# EAGLE design AIRES_MEGA (EAGLE 9.5.2)
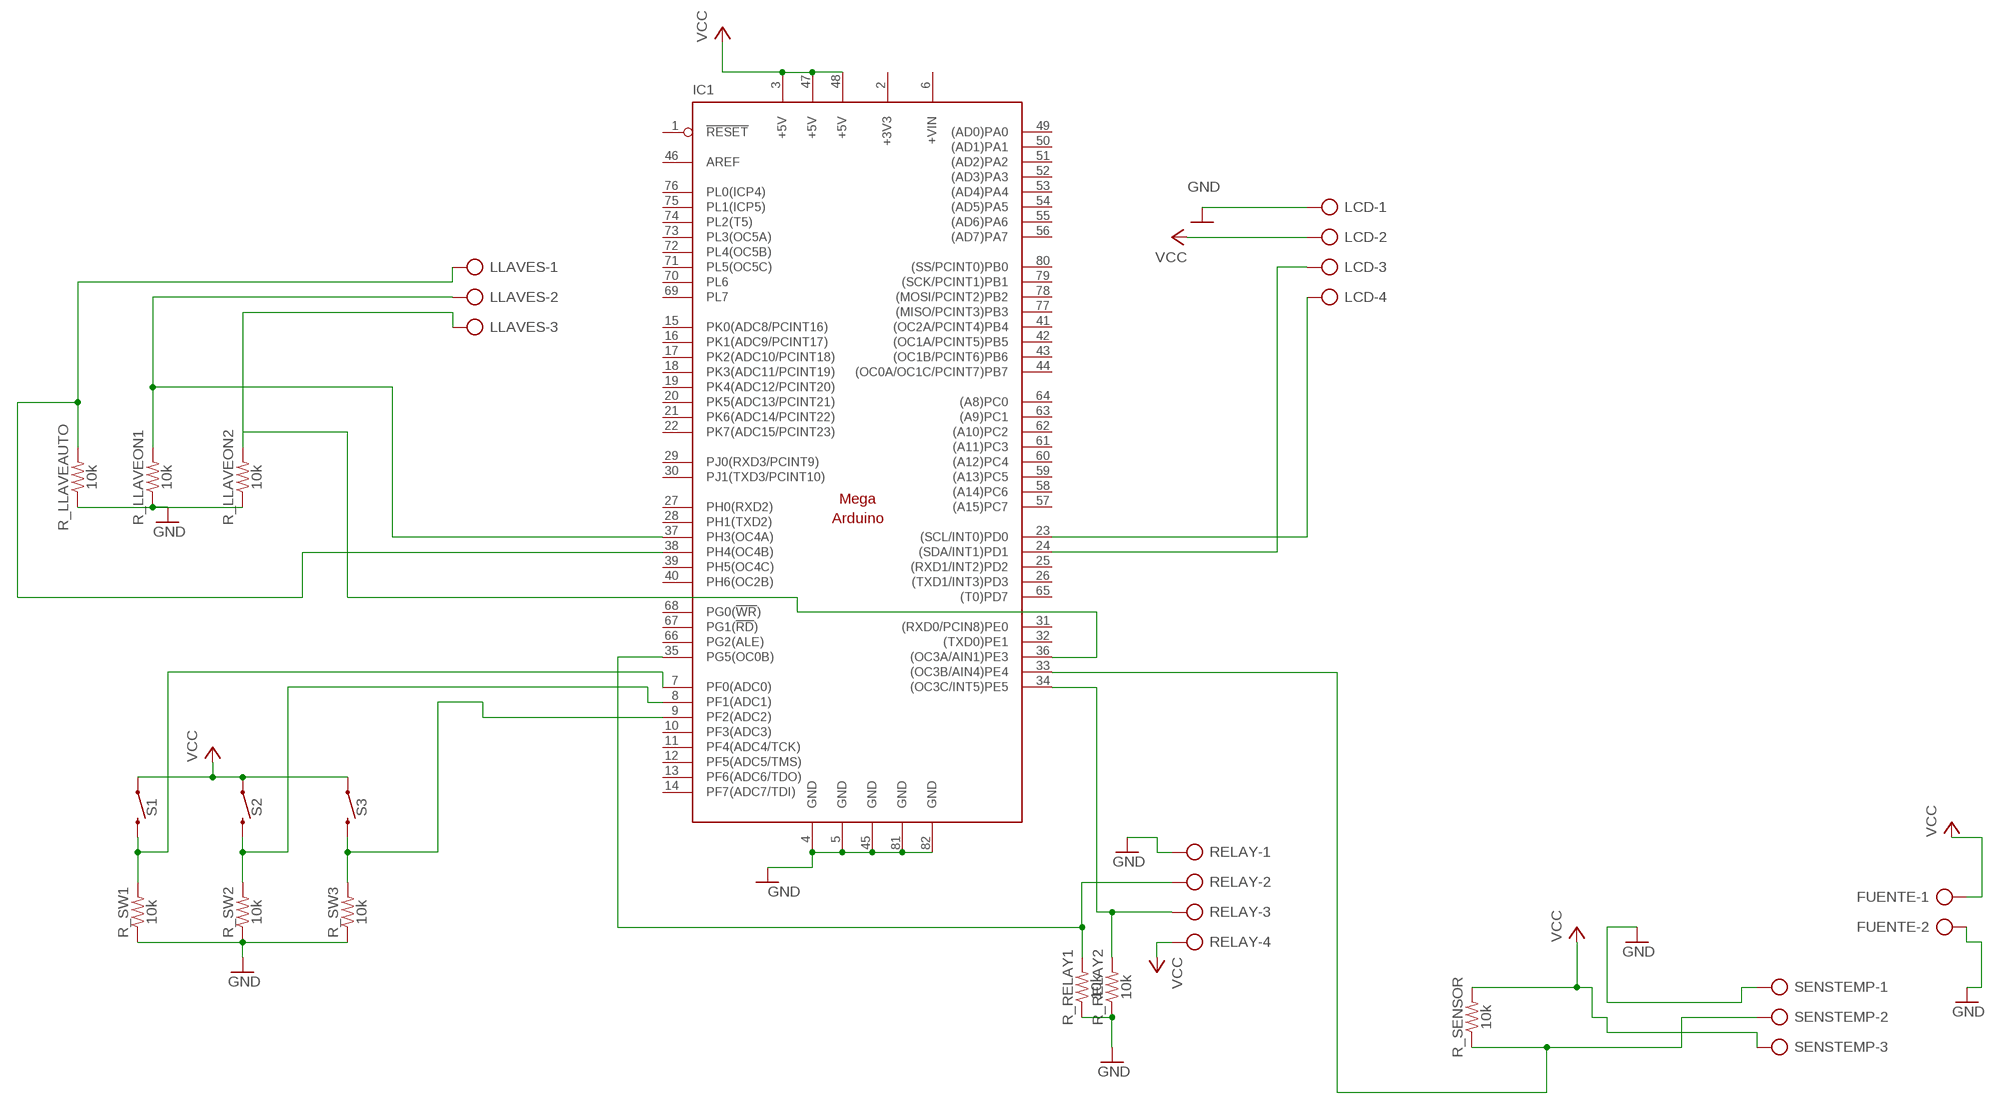
[diagram p0: schematic, sheet 1]

## Parts
FUENTE  AK500/2  [AK500/2]
IC1  MEGAARDUINO_1  [MEGA_ARDUINO]
LCD  AK500/4  [AK500/4]
LLAVES  AK500/3  [AK500/3]
R_LLAVEAUTO  10k  10KOHM-HORIZ-1/4W-1%  [AXIAL-0.3]
R_LLAVEON1  10k  10KOHM-HORIZ-1/4W-1%  [AXIAL-0.3]
R_LLAVEON2  10k  10KOHM-HORIZ-1/4W-1%  [AXIAL-0.3]
R_RELAY1  10k  10KOHM-HORIZ-1/4W-1%  [AXIAL-0.3]
R_RELAY2  10k  10KOHM-HORIZ-1/4W-1%  [AXIAL-0.3]
R_SENSOR  10k  10KOHM-HORIZ-1/4W-1%  [AXIAL-0.3]
R_SW1  10k  10KOHM-HORIZ-1/4W-1%  [AXIAL-0.3]
R_SW2  10k  10KOHM-HORIZ-1/4W-1%  [AXIAL-0.3]
R_SW3  10k  10KOHM-HORIZ-1/4W-1%  [AXIAL-0.3]
RELAY  AK500/4  [AK500/4]
S1  MOMENTARY-SWITCH-SPST-PTH-12MM  [TACTILE_SWITCH_PTH_12MM]
S2  MOMENTARY-SWITCH-SPST-PTH-12MM  [TACTILE_SWITCH_PTH_12MM]
S3  MOMENTARY-SWITCH-SPST-PTH-12MM  [TACTILE_SWITCH_PTH_12MM]
SENSTEMP  AK500/3  [AK500/3]

## Nets
GND: FUENTE.2 IC1.4(GND) IC1.5(GND) IC1.45(GND) IC1.81(GND) IC1.82(GND) LCD.1 R_LLAVEAUTO.P$1 R_LLAVEON1.P$1 R_LLAVEON2.P$1 R_RELAY1.P$1 R_RELAY2.P$1 R_SW1.P$1 R_SW2.P$1 R_SW3.P$1 RELAY.1 SENSTEMP.1
N$1: IC1.24((SDA/INT1)PD1) LCD.3
N$2: IC1.35(PG5(OC0B)) R_RELAY1.P$2 RELAY.2
N$4: IC1.38(PH4(OC4B)) LLAVES.1 R_LLAVEAUTO.P$2
N$5: IC1.7(PF0(ADC0)) R_SW1.P$2 S1.3
N$6: IC1.37(PH3(OC4A)) LLAVES.2 R_LLAVEON1.P$2
N$7: IC1.8(PF1(ADC1)) R_SW2.P$2 S2.3
N$8: IC1.23((SCL/INT0)PD0) LCD.4
N$9: IC1.34((OC3C/INT5)PE5) R_RELAY2.P$2 RELAY.3
N$11: IC1.9(PF2(ADC2)) R_SW3.P$2 S3.3
N$12: IC1.36((OC3A/AIN1)PE3) LLAVES.3 R_LLAVEON2.P$2
PIN_SENSOR: IC1.33((OC3B/AIN4)PE4) R_SENSOR.P$1 SENSTEMP.2
VCC: FUENTE.1 IC1.3(+5V) IC1.47(+5V) IC1.48(+5V) LCD.2 R_SENSOR.P$2 RELAY.4 S1.1 S2.1 S3.1 SENSTEMP.3
Unconnected: IC1.1(!RESET) IC1.10(PF3(ADC3)) IC1.11(PF4(ADC4/TCK)) IC1.12(PF5(ADC5/TMS)) IC1.13(PF6(ADC6/TDO)) IC1.14(PF7(ADC7/TDI)) IC1.15(PK0(ADC8/PCINT16)) IC1.16(PK1(ADC9/PCINT17)) IC1.17(PK2(ADC10/PCINT18)) IC1.18(PK3(ADC11/PCINT19)) IC1.19(PK4(ADC12/PCINT20)) IC1.20(PK5(ADC13/PCINT21)) IC1.21(PK6(ADC14/PCINT22)) IC1.22(PK7(ADC15/PCINT23)) IC1.25((RXD1/INT2)PD2) IC1.26((TXD1/INT3)PD3) IC1.27(PH0(RXD2)) IC1.28(PH1(TXD2)) IC1.29(PJ0(RXD3/PCINT9)) IC1.30(PJ1(TXD3/PCINT10)) IC1.31((RXD0/PCIN8)PE0) IC1.32((TXD0)PE1) IC1.39(PH5(OC4C)) IC1.40(PH6(OC2B)) IC1.41((OC2A/PCINT4)PB4) IC1.42((OC1A/PCINT5)PB5) IC1.43((OC1B/PCINT6)PB6) IC1.44((OC0A/OC1C/PCINT7)PB7) IC1.46(AREF) IC1.49((AD0)PA0) IC1.50((AD1)PA1) IC1.51((AD2)PA2) IC1.52((AD3)PA3) IC1.53((AD4)PA4) IC1.54((AD5)PA5) IC1.55((AD6)PA6) IC1.56((AD7)PA7) IC1.57((A15)PC7) IC1.58((A14)PC6) IC1.59((A13)PC5) IC1.60((A12)PC4) IC1.61((A11)PC3) IC1.62((A10)PC2) IC1.63((A9)PC1) IC1.64((A8)PC0) IC1.65((T0)PD7) IC1.66(PG2(ALE)) IC1.67(PG1(!RD!)) IC1.68(PG0(!WR!)) IC1.69(PL7) IC1.70(PL6) IC1.71(PL5(OC5C)) IC1.72(PL4(OC5B)) IC1.73(PL3(OC5A)) IC1.74(PL2(T5)) IC1.75(PL1(ICP5)) IC1.76(PL0(ICP4)) IC1.77((MISO/PCINT3)PB3) IC1.78((MOSI/PCINT2)PB2) IC1.79((SCK/PCINT1)PB1) IC1.80((SS/PCINT0)PB0)

## Power pins joined to a net without a drawn wire
+3V3: IC1.2(+3V3)
+VIN: IC1.6(+VIN)

## Library data of the parts
FUENTE = con-ptr500:AK500/2: CONNECTOR; OC_FARNELL: unknown; OC_NEWARK: unknown
IC1 = arduino:MEGAARDUINO_1: The Arduino Mega is a microcontroller board based on the ATmega1280. - 54 digital input/output pins (of which 14 can be used as PWM outputs) - 16 analog inputs - 4 UARTs (hardware serial ports) - 16 MHz crystal oscillator - USB connection - power jack - ICSP header - reset button It contains everything needed to support the microcontroller; simply connect it to a computer with a USB cable or power it with a AC-to-DC adapter or battery to get started. The Mega is compatible with most shields designed for the Arduino Duemilanove or Diecimila. http://arduino.cc/en/Main/ArduinoBoardMega
LCD RELAY = con-ptr500:AK500/4: CONNECTOR; OC_FARNELL: unknown; OC_NEWARK: unknown
LLAVES SENSTEMP = con-ptr500:AK500/3: CONNECTOR; OC_FARNELL: unknown; OC_NEWARK: unknown
R_LLAVEAUTO R_LLAVEON1 R_LLAVEON2 R_RELAY1 R_RELAY2 R_SENSOR R_SW1-R_SW3 = SparkFun-Resistors:10KOHM: 10kΩ resistor A resistor is a passive two-terminal electrical component that implements electrical resistance as a circuit element. Resistors act to reduce current flow, and, at the same time, act to lower voltage levels within circuits. - Wikipedia; PROD_ID: RES-12183
S1-S3 = SparkFun-Switches:MOMENTARY-SWITCH-SPST: Momentary Switch (Pushbutton) - SPST Normally-open (NO) SPST momentary switches (buttons, pushbuttons). Variants PTH-12MM - 12mm square, through-hole Momentary Pushbutton Switch - 12mm Square <https://www.sparkfun.com/products/9190> (COM-09190) PTH-6.0MM, PTH-6.0MM-KIT - 6.0mm square, through-hole Mini Pushbutton Switch <https://www.sparkfun.com/products/97> (COM-00097) KIT package intended for soldering kit's - only one side of pads' copper is exposed. PTH-RIGHT-ANGLE-KIT - Right-angle, through-hole Right Angle Tactile Button <https://www.sparkfun.com/products/10791> - Used on SparkFun BigTime Watch Kit <https://www.sparkfun.com/products/11734> SMD-12MM - 12mm square, surface-mount Tactile Button - SMD (12mm) <https://www.sparkfun.com/products/12993> (COM-12993) Used on SparkFun PicoBoard <https://www.sparkfun.com/products/11888> SMD-4.5MM - 4.5mm Square Trackball Switch Used on SparkFun Blackberry Trackballer Breakout <https://www.sparkfun.com/products/13169> SMD-4.6MMX2.8MM - 4.60mm x 2.80mm, surface mount Used on SparkFun SAMD21 Mini Breakout <https://www.sparkfun.com/products/13664> SMD-5.2MM, SMD-5.2-REDUNDANT - 5.2mm square, surface-mount Mini Pushbutton Switch - SMD <https://www.sparkfun.com/products/8720> (COM-08720) Used on Arduino Pro Mini <https://www.sparkfun.com/products/11114> REDUNDANT package connects both switch circuits together SMD-6.0X3.5MM - 6.0 x 3.5mm, surface mount Momentary Reset Switch SMD <https://www.sparkfun.com/products/8229> (COM-08229) SMD-6.2MM-TALL - 6.2mm square, surface mount Tactile Button - SMD (6mm) <https://www.sparkfun.com/products/12992> Used on SparkFun Digital Sandbox <https://www.sparkfun.com/products/12651> SMD-RIGHT-ANGLE - Right-angle, surface mount Used on SparkFun Block for Intel® Edison - Arduino <https://www.sparkfun.com/products/13036>; PROD_ID: SWCH-09185; SF_SKU: COM-09190

## Net classes
0 default: width 0.762 mm, drill 0.254 mm, clearance 0.254 mm

## Board
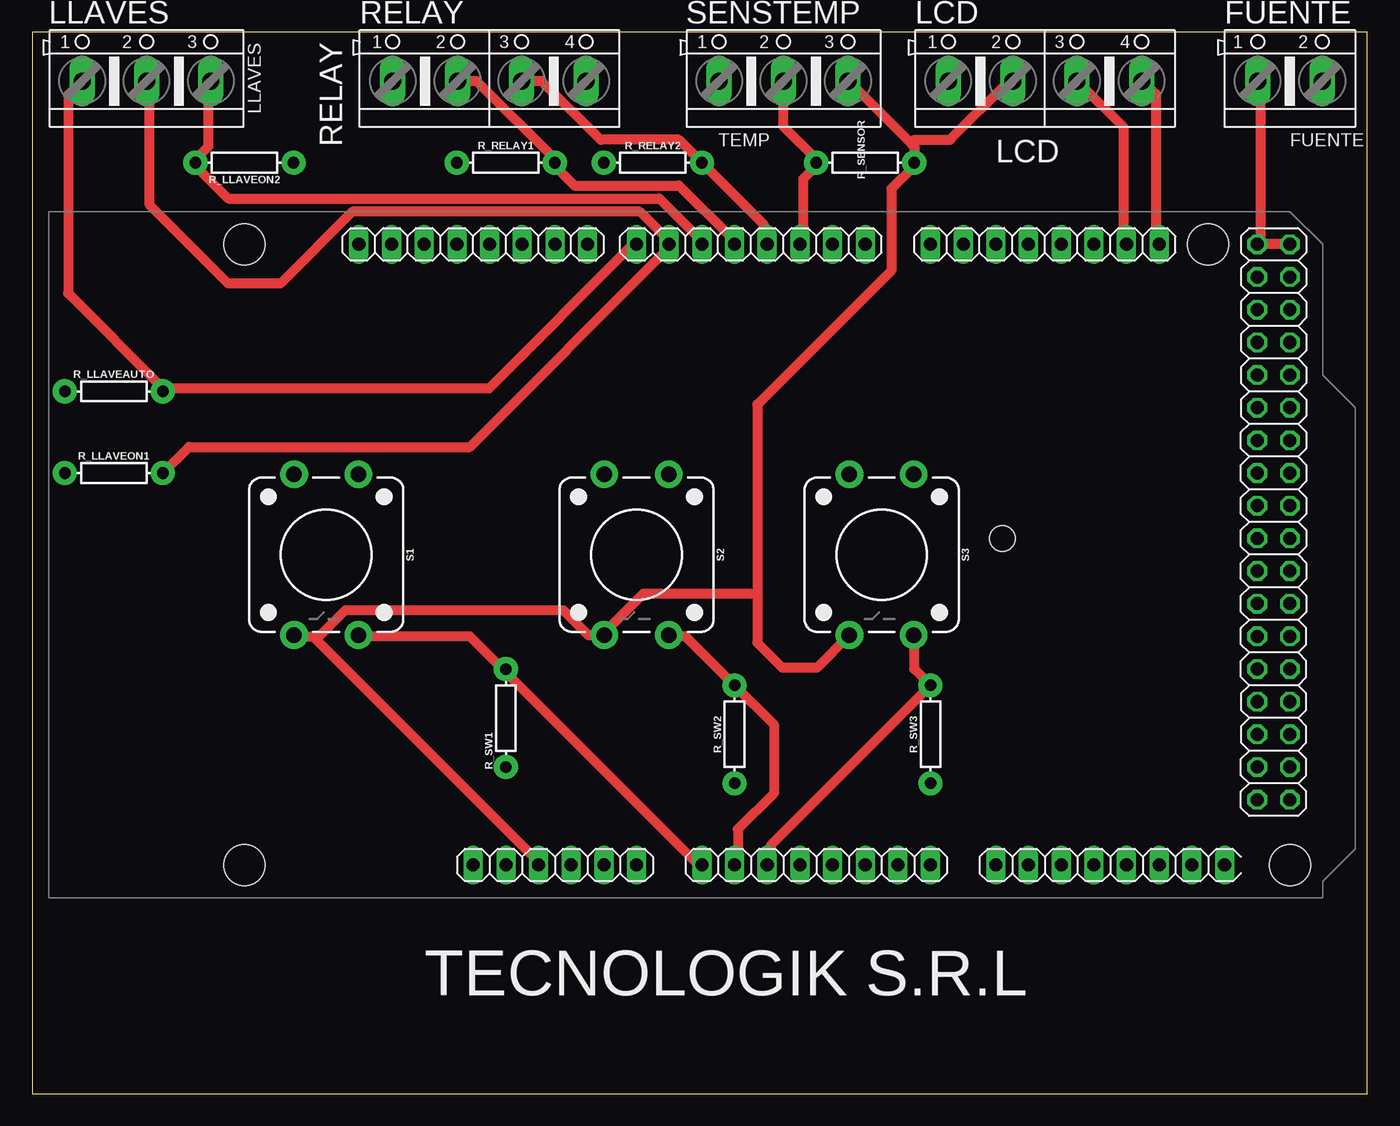
[diagram p1: board, top side]
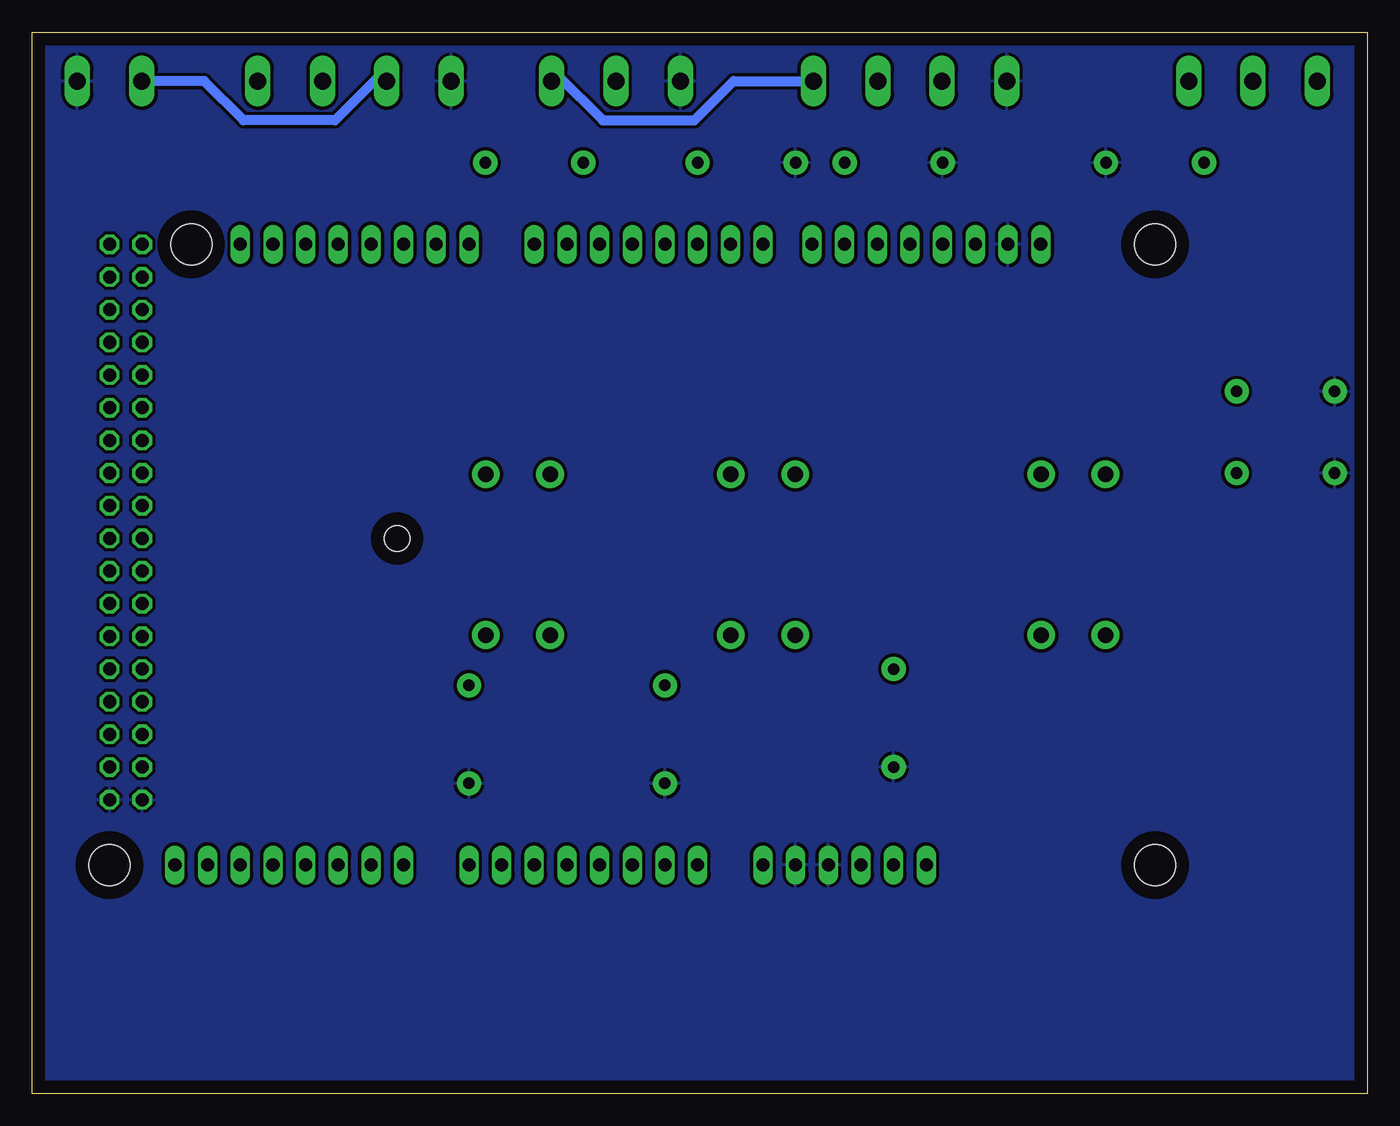
[diagram p2: board, bottom side, seen from below]

Size 103.81 x 82.54 mm. Coordinates in mm from the lower left corner, seen from the top.
Outline: 0,0 103.81,0 103.81,82.54 0,82.54 0,0
Copper layers (1*16): Top 0.035mm / dielectric 1.5mm / Bottom 0.035mm
Design rules "default": minimum track width 6mil, minimum drill 0.35mm, track to track 6mil, track to pad 6mil, pad to pad 6mil, via to via 6mil, smd to smd 6mil, copper to edge 40mil, drill to drill 6mil, minimum pad ring 10mil, minimum via ring 8mil, stop-mask expansion 4mil, vias tented up to drill 0mil, thermal gap 10mil

### Footprints (pad centres in the part's own frame; a part is rotated, then mirrored left to right if it is on the bottom)
AK500/2 = drill 1.321 long: 1 -2.515,0; 2 2.515,0
MEGA_ARDUINO = drill 1.016 long: 1 33.02,2.54; 2 35.56,2.54; 3 38.1,2.54; 4 40.64,2.54; 5 43.18,2.54; 6 45.72,2.54; 7 50.8,2.54; 8 53.34,2.54; 9 55.88,2.54; 10 58.42,2.54; 11 60.96,2.54; 12 63.5,2.54; 13 66.04,2.54; 14 68.58,2.54; 15 73.66,2.54; 16 76.2,2.54; 17 78.74,2.54; 18 81.28,2.54; 19 83.82,2.54; 20 86.36,2.54; 21 88.9,2.54; 22 91.44,2.54; 23 86.36,50.8; 24 83.82,50.8; 25 81.28,50.8; 26 78.74,50.8; 27 76.2,50.8; 28 73.66,50.8; 29 71.12,50.8; 30 68.58,50.8; 31 63.5,50.8; 32 60.96,50.8; 33 58.42,50.8; 34 55.88,50.8; 35 53.34,50.8; 36 50.8,50.8; 37 48.26,50.8; 38 45.72,50.8; 39 41.91,50.8; 40 39.37,50.8; 41 36.83,50.8; 42 34.29,50.8; 43 31.75,50.8; 44 29.21,50.8; 45 26.67,50.8; 46 24.13,50.8 | drill 1.016 octagon: 47 93.98,50.8; 48 96.52,50.8; 49 93.98,48.26; 50 96.52,48.26; 51 93.98,45.72; 52 96.52,45.72; 53 93.98,43.18; 54 96.52,43.18; 55 93.98,40.64; 56 96.52,40.64; 57 93.98,38.1; 58 96.52,38.1; 59 93.98,35.56; 60 96.52,35.56; 61 93.98,33.02; 62 96.52,33.02; 63 93.98,30.48; 64 96.52,30.48; 65 93.98,27.94; 66 96.52,27.94; 67 93.98,25.4; 68 96.52,25.4; 69 93.98,22.86; 70 96.52,22.86; 71 93.98,20.32; 72 96.52,20.32; 73 93.98,17.78; 74 96.52,17.78; 75 93.98,15.24; 76 96.52,15.24; 77 93.98,12.7; 78 96.52,12.7; 79 93.98,10.16; 80 96.52,10.16; 81 93.98,7.62; 82 96.52,7.62 | hole 3.2: 15.24,50.8; 15.24,2.54; 90.17,50.8; 96.52,2.54 | hole 2: 74.168,27.94
AK500/4 = drill 1.321 long: 1 -7.518,0; 2 -2.489,0; 3 2.489,0; 4 7.518,0
AK500/3 = drill 1.321 long: 1 -5.004,0; 2 0,0; 3 5.004,0
AXIAL-0.3 = drill 0.9 pad 1.88: P$1 -3.81,0; P$2 3.81,0
TACTILE_SWITCH_PTH_12MM = drill 1.2 pad 2.159: 1 6.25,-2.5; 2 -6.25,-2.5; 3 6.25,2.5; 4 -6.25,2.5

### Placement (x,y rotation side)
FUENTE  97.79,78.74 0 top
IC1  1.27,15.24 0 top
LCD  78.74,78.74 0 top
LLAVES  8.89,78.74 0 top
R_LLAVEAUTO  6.35,54.61 0 top
R_LLAVEON1  6.35,48.26 0 top
R_LLAVEON2  16.51,72.39 180 top
R_RELAY1  36.83,72.39 0 top
R_RELAY2  48.26,72.39 0 top
R_SENSOR  64.77,72.39 0 top
R_SW1  36.83,29.21 90 top
R_SW2  54.61,27.94 90 top
R_SW3  69.85,27.94 90 top
RELAY  35.56,78.74 0 top
S1  22.86,41.91 270 top
S2  46.99,41.91 270 top
S3  66.04,41.91 270 top
SENSTEMP  58.42,78.74 0 top

### Tracks (layer width: path | path; a pad name or v marks a point on that pad's centre or on a via)
GND
  pour Bottom: -2.54,85.09 -2.54,-5.08 110.49,-5.08 114.3,-1.27 114.3,83.82 110.49,87.63 0,87.63
N$1
  Top 0.762: IC1.24 84.84,66.04 84.84,75.18 81.28,78.74 LCD.3
N$2
  Top 0.762: IC1.35 54.36,66.04 54.36,66.55 50.29,70.61 42.16,70.61 40.64,72.14 R_RELAY1.P$2 40.64,72.64 34.54,78.74 RELAY.2
N$4
  Top 0.762: 10.16,54.86 35.56,54.86 46.74,66.04 IC1.38 | LLAVES.1 2.79,77.65 2.79,62.23 10.16,54.86 | 10.16,54.86 R_LLAVEAUTO.P$2
N$5
  Top 0.762: 36.58,33.02 51.82,17.78 IC1.7 | 36.58,33.02 34.04,35.56 25.4,35.56 S1.3 | 36.58,33.02 R_SW1.P$2
N$6
  Top 0.762: R_LLAVEON1.P$2 12.19,50.29 34.04,50.29 49.28,65.53 49.28,66.04 IC1.37 49.78,66.04 47.24,68.58 24.89,68.58 19.3,62.99 15.24,62.99 9.14,69.09 9.14,78.74 LLAVES.2
N$7
  Top 0.762: IC1.8 54.86,17.78 54.86,20.57 57.66,23.37 57.66,28.7 R_SW2.P$2 50.8,35.56 49.78,35.56 S2.3
N$8
  Top 0.762: IC1.23 87.38,66.04 87.38,77.72 86.36,78.74 LCD.4
N$9
  Top 0.762: IC1.34 56.9,66.04 56.9,67.56 R_RELAY2.P$2 50.29,74.17 44.2,74.17 39.62,78.74 RELAY.3
N$11
  Top 0.762: IC1.9 57.4,17.78 57.4,19.3 R_SW3.P$2 68.58,33.02 68.58,35.56 S3.3
N$12
  Top 0.762: IC1.36 51.82,66.04 51.82,66.55 48.77,69.6 15.24,69.6 12.7,72.14 R_LLAVEON2.P$2 12.7,72.64 13.72,73.66 13.72,78.74 LLAVES.3
PIN_SENSOR
  Top 0.762: IC1.33 59.94,66.04 59.94,71.12 60.96,72.14 R_SENSOR.P$1 60.96,72.64 58.42,75.18 SENSTEMP.2
VCC
  Top 0.762: 56.39,38.86 47.5,38.86 44.7,36.07 S2.1 43.22,35.66 41.29,37.59 24.38,37.59 22.1,35.31 | S3.1 61,33.12 58.32,33.12 56.39,35.05 56.39,38.86 | 22.1,35.31 21.84,35.56 20.83,35.56 S1.1 | 22.1,35.31 39.12,18.29 39.12,17.78 IC1.3 | IC1.48 95.5,66.04 | 95.5,66.04 95.5,78.74 FUENTE.1 | 95.5,66.04 IC1.47 | 68.33,73.91 63.5,78.74 SENSTEMP.3 | 68.33,73.91 68.58,73.66 R_SENSOR.P$2 68.58,72.14 66.8,70.36 66.8,64.01 56.39,53.59 56.39,38.86 | LCD.2 75.95,78.74 71.37,74.17 68.58,74.17 68.33,73.91
  Bottom 0.762: RELAY.4 49.28,78.74 52.32,75.69 59.44,75.69 62.99,79.25 63.5,78.74 SENSTEMP.3 | FUENTE.1 90.42,78.74 87.38,75.69 80.26,75.69 76.71,79.25 76.2,78.74 LCD.2

### Text on the board
tPlace: LLAVES | RELAY | TEMP | FUENTE | LCD | TECNOLOGIK S.R.L